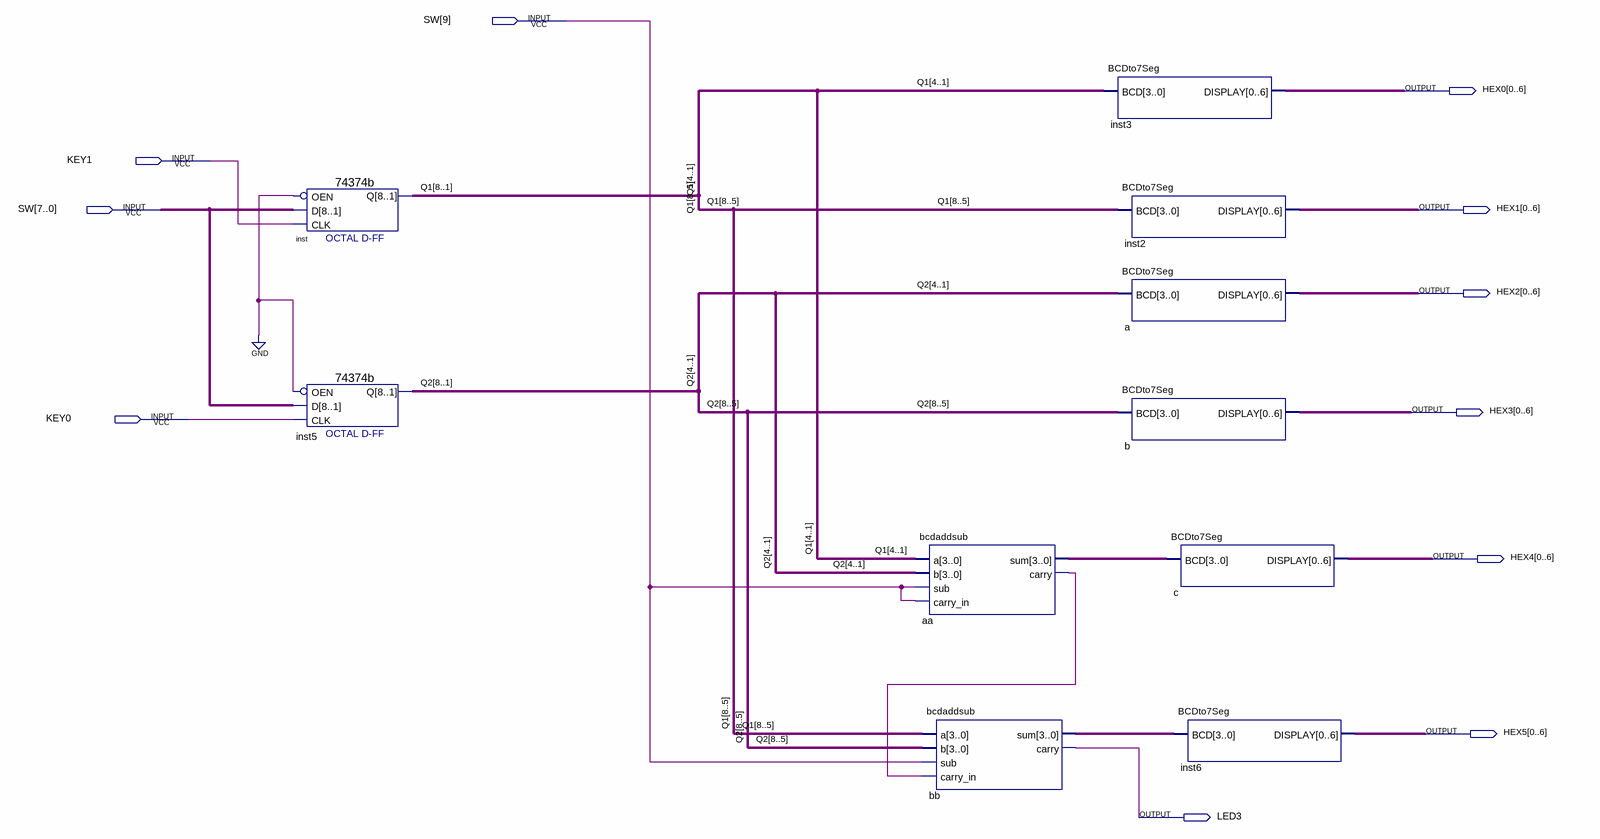
[diagram p0: schematic sheet]
// Quartus schematic NumDisplay.bdf as structural Verilog: 10 symbols, 11 pins
module NumDisplay (
  input  [9:0] SW,
  input  KEY1,
  input  KEY0,
  output [0:6] HEX0,
  output [0:6] HEX1,
  output [0:6] HEX2,
  output [0:6] HEX3,
  output [0:6] HEX4,
  output [0:6] HEX5,
  output LED3
);

  wire aa_carry;
  wire [3:0] aa_sum, bb_sum;
  wire [8:1] Q1, Q2;

  \74374b  inst (.D(SW[7:0]), .OEN(1'b0), .CLK(KEY1), .Q(Q1));
  \74374b  inst5 (.D(SW[7:0]), .OEN(1'b0), .CLK(KEY0), .Q(Q2));
  bcdaddsub aa (.a(Q1[4:1]), .b(Q2[4:1]), .sub(SW[9]), .carry_in(SW[9]), .sum(aa_sum), .carry(aa_carry));
  bcdaddsub bb (.a(Q1[8:5]), .b(Q2[8:5]), .sub(SW[9]), .carry_in(aa_carry), .sum(bb_sum), .carry(LED3));
  BCDto7Seg inst3 (.BCD(Q1[4:1]), .DISPLAY(HEX0));
  BCDto7Seg inst2 (.BCD(Q1[8:5]), .DISPLAY(HEX1));
  BCDto7Seg a (.BCD(Q2[4:1]), .DISPLAY(HEX2));
  BCDto7Seg b (.BCD(Q2[8:5]), .DISPLAY(HEX3));
  BCDto7Seg c (.BCD(aa_sum), .DISPLAY(HEX4));
  BCDto7Seg inst6 (.BCD(bb_sum), .DISPLAY(HEX5));
endmodule
